# EasyEDA Pro project ProPrj_主车电路板.epro, board PCB2
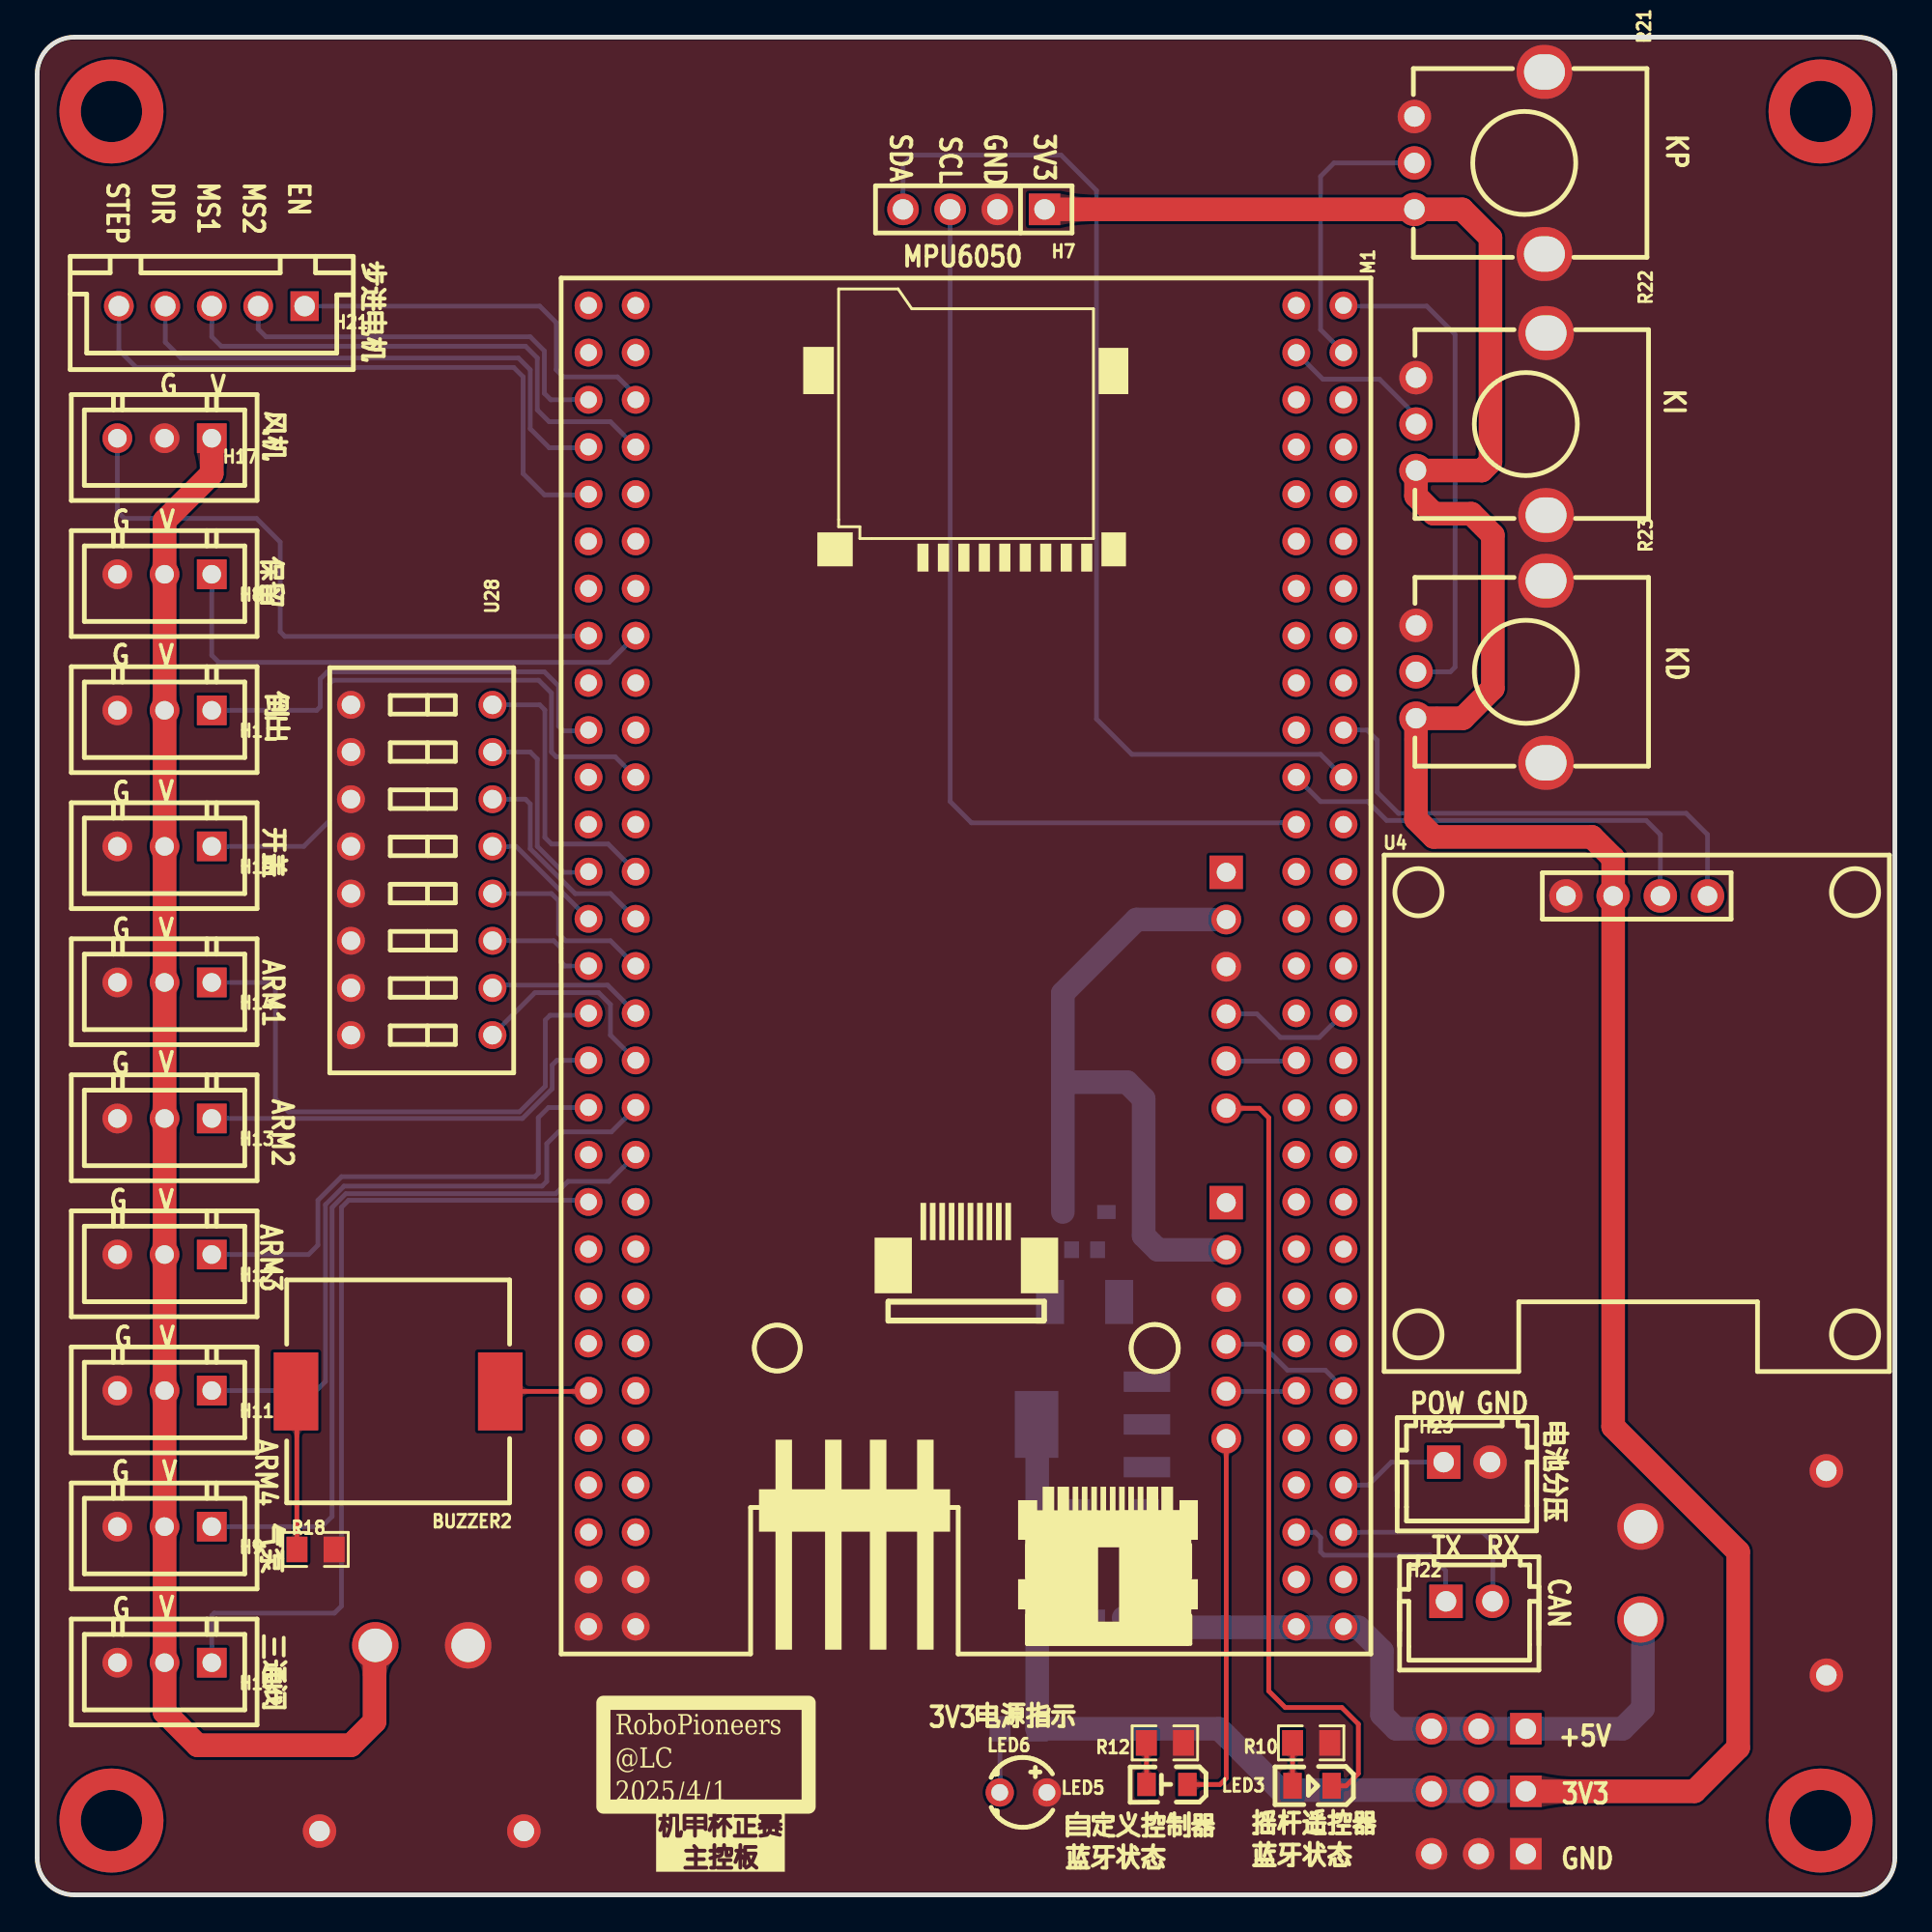
[diagram p7: board, top side]
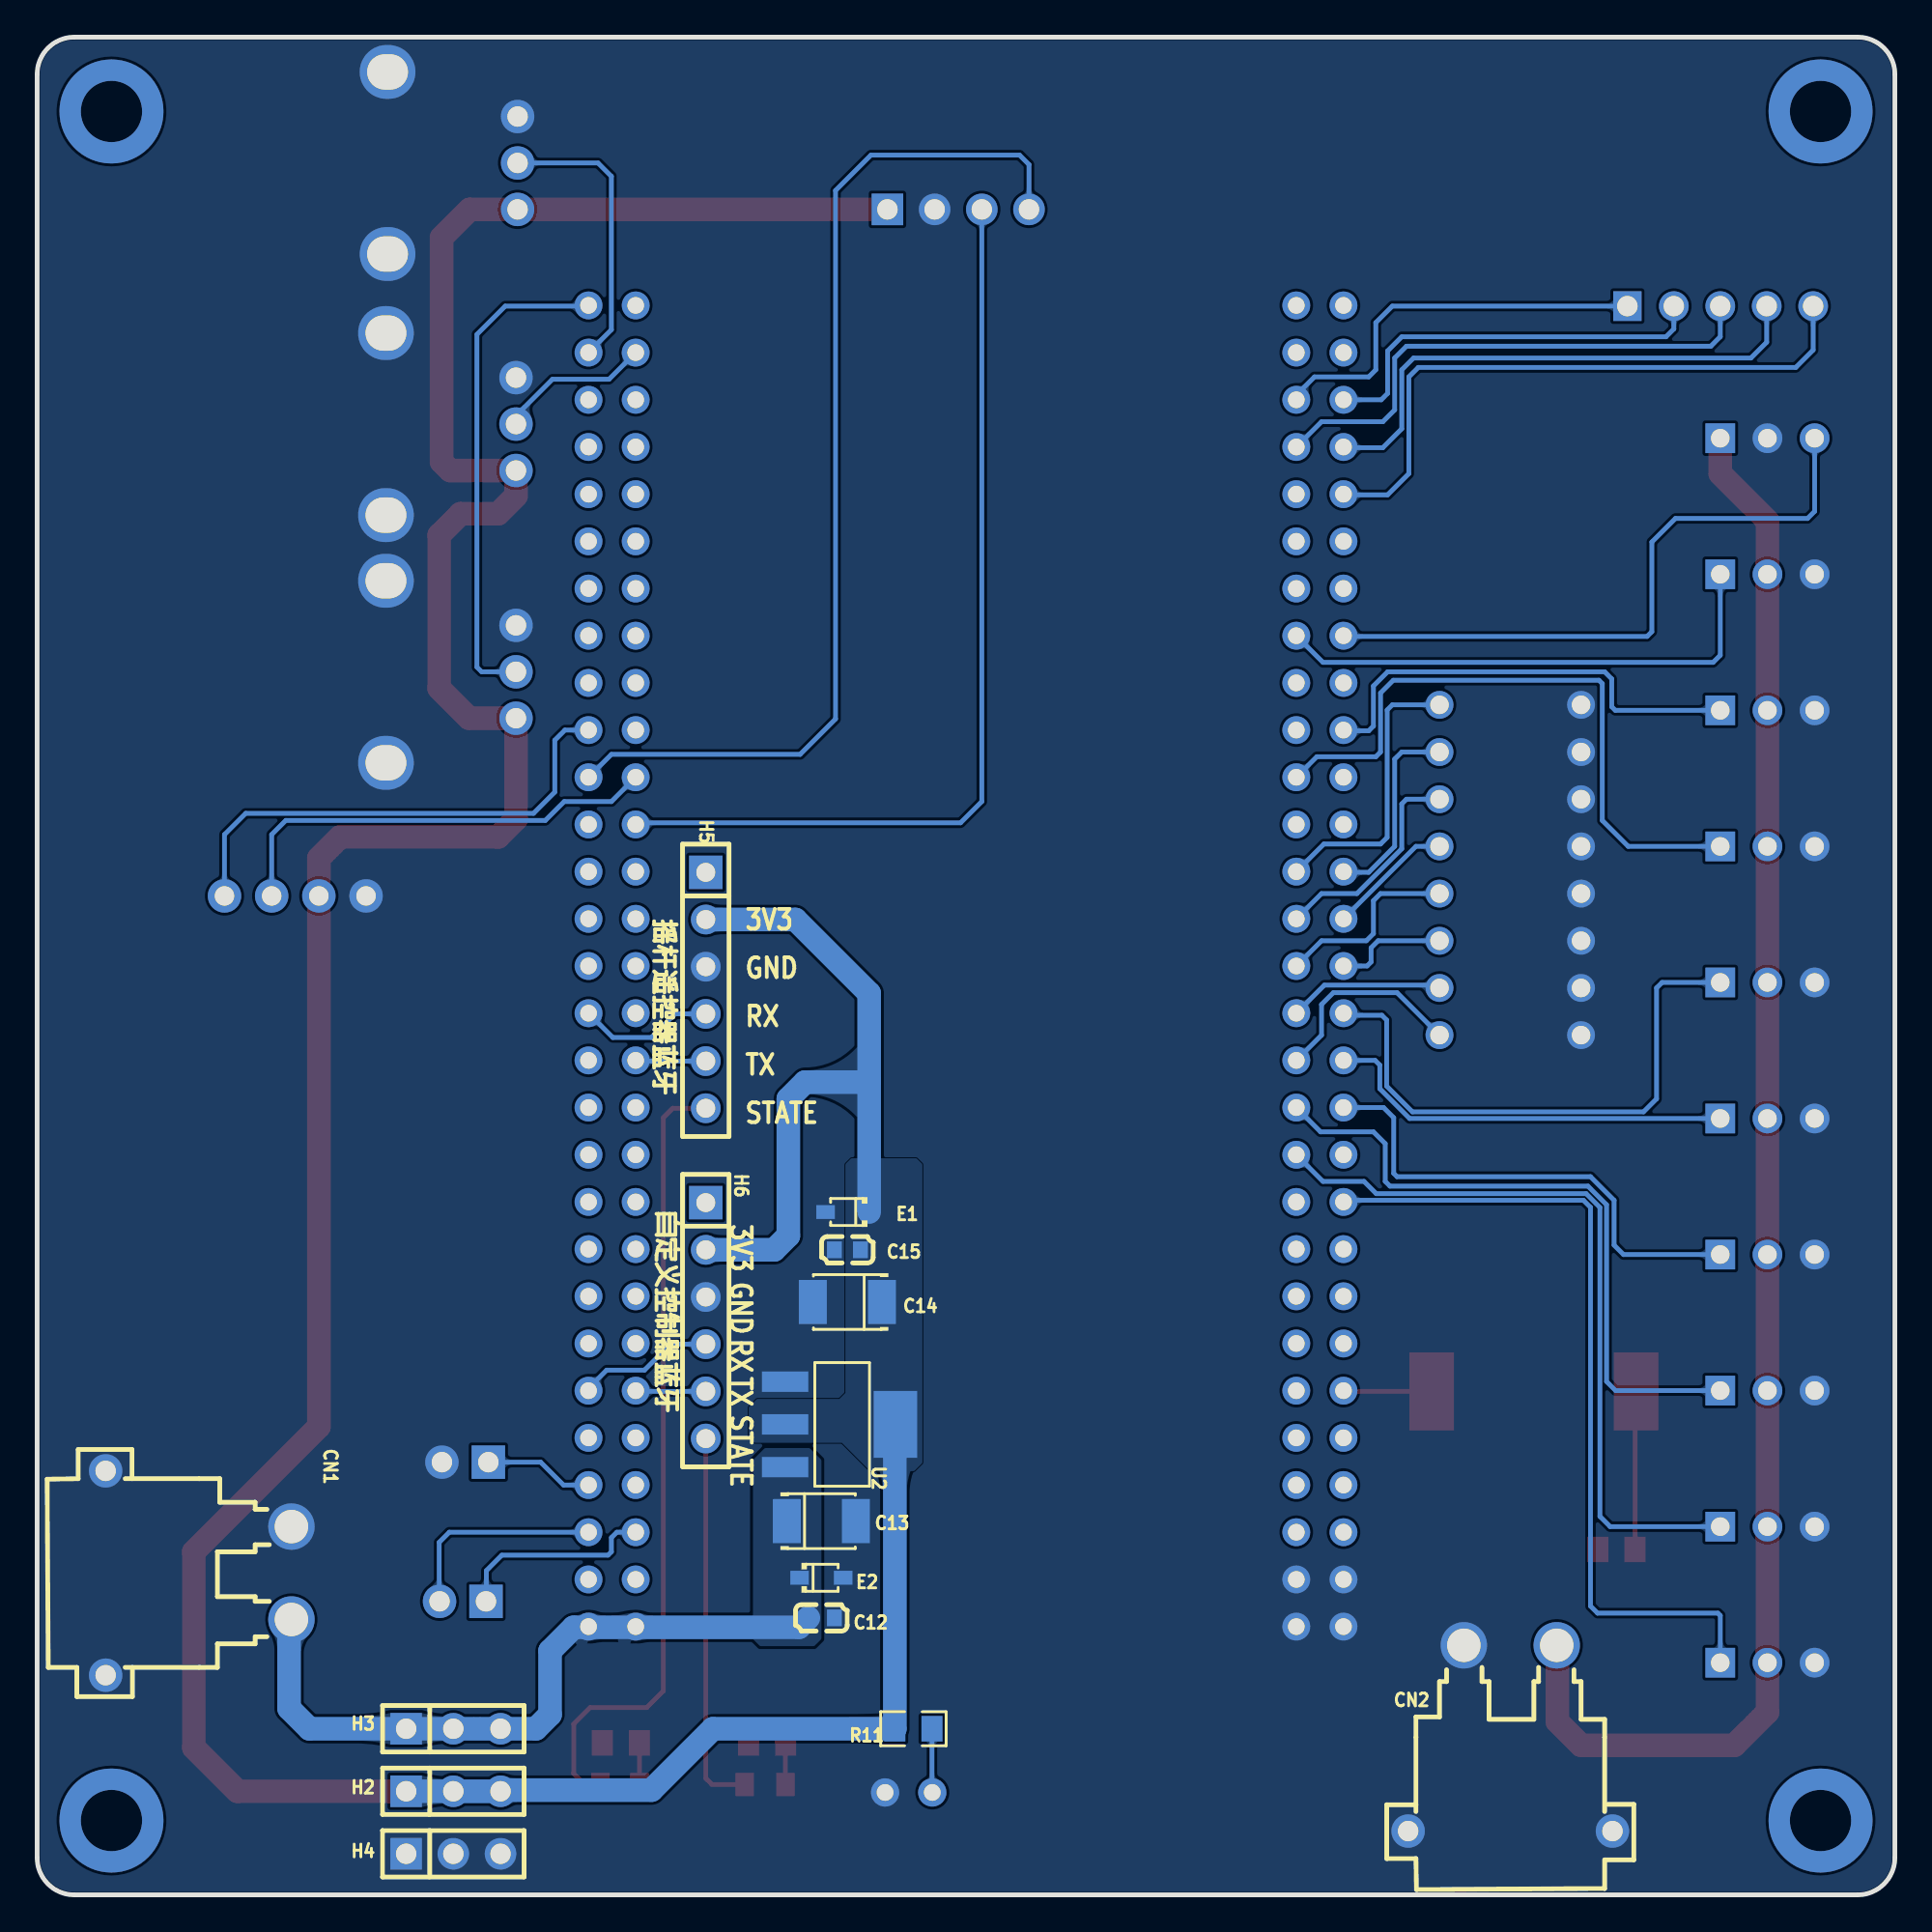
[diagram p8: board, bottom side, seen from below]

Outline 100 x 100 mm; copper layers: Top Layer, Bottom Layer. Coordinates in mm from the lower left corner of the outline.
Outline path: 0,98 0,2 arc(0.59,0.59) 2,0 98,0 arc(99.41,0.59) 100,2 100,98 arc(99.41,99.41) 98,100 2,100 arc(0.59,99.41) 0,98
Stack: Top Layer 0.035mm / Dielectric1 1.51mm FR4 er 4.5 / Bottom Layer 0.035mm

## Design rules (mm)
template: 自定义配置
spacing copperThickness1oz (default): track to track 0.102, other pairs 0.152 to 0.3
spacing copperThickness2oz: track to track 0.203, other pairs 0.152 to 0.3
track width copperThickness1oz (default): min 0.127, default 0.254, max 2.54
track width copperThickness2oz: min 0.203, default 0.254, max 2.54
differential pair differentialPair (default): width min 0.127, default 0.254, max 2.54; gap min 0.152, default 0.152
via viaSize (default): diameter min 0.5, default 0.61, max 10; hole min 0.3, default 0.305, max 6.3
net GND uses copperRegion1
net +5V uses copperRegion1
net 3V3 uses copperRegion1
pour e564 uses copperRegion1
pour e603 uses copperRegion1

## Placement (name value [footprint] x y rotation side)
BUZZER2  4kHz  [BUZ-SMD_L12.0-W12.0-P11.6]  19.43 27.1 180 top
C12  100nF  [C0603]  57.78 14.91 180 bottom
C13  220uF  [CASE-B_3528]  57.78 20.12 180 bottom
C14  220uF  [CASE-B_3528]  56.38 31.91 0 bottom
C15  100nF  [C0603]  56.38 34.72 180 bottom
CN1  XT30PW-M30.G.Y  [CONN-TH_XT30PW-M]  91.31 17.32 270 bottom
CN2  XT30PW-M30.G.Y  [CONN-TH_XT30PW-M]  20.7 8.43 180 bottom
E1  CESD3V3D3 YU  [SOD-323_L1.8-W1.3-LS2.5-RD]  56.38 36.76 0 bottom
E2  CESD5V0D3 ZA  [SOD-323_L1.8-W1.3-LS2.5-RD]  57.78 17.07 180 bottom
H1  ZX-XH2.54-3PZZ  [CONN-TH_3P-P2.54_2501S-3P]  6.86 63.76 180 top
H2  PZ254V-11-03P  [HDR-TH_3P-P2.54-V-M]  77.6 5.58 180 bottom
H3  PZ254V-11-03P  [HDR-TH_3P-P2.54-V-M]  77.6 8.94 180 bottom
H4  PZ254V-11-03P  [HDR-TH_3P-P2.54-V-M]  77.6 2.21 180 bottom
H5  PM254V-11-06-H85  [HDR-TH_6P-P2.54-V-F]  64.01 48.69 270 bottom
H6  PM254V-11-06-H85  [HDR-TH_6P-P2.54-V-F]  64.01 30.91 270 bottom
H7  2.54-1*4P母  [HDR-TH_4P-P2.54-V-F]  50.42 90.73 180 top
H8  ZX-XH2.54-3PZZ  [CONN-TH_3P-P2.54_2501S-3P]  6.86 71.09 180 top
H9  ZX-XH2.54-3PZZ  [CONN-TH_3P-P2.54_2501S-3P]  6.86 19.82 180 top
H10  ZX-XH2.54-3PZZ  [CONN-TH_3P-P2.54_2501S-3P]  6.86 12.5 180 top
H11  ZX-XH2.54-3PZZ  [CONN-TH_3P-P2.54_2501S-3P]  6.86 27.14 180 top
H12  ZX-XH2.54-3PZZ  [CONN-TH_3P-P2.54_2501S-3P]  6.86 34.47 180 top
H13  ZX-XH2.54-3PZZ  [CONN-TH_3P-P2.54_2501S-3P]  6.86 41.79 180 top
H14  ZX-XH2.54-3PZZ  [CONN-TH_3P-P2.54_2501S-3P]  6.86 49.12 180 top
H17  ZX-XH2.54-3PZZ  [CONN-TH_3P-P2.54_2501S-3P]  6.86 78.41 180 top
H19  ZX-XH2.54-3PZZ  [CONN-TH_3P-P2.54_2501S-3P]  6.86 56.44 180 top
H21  ZX-XH2.54-5PZZ  [CONN-TH_5P-P2.50_ZX-XH2.54-5PZZ]  9.4 85.52 180 top
H22  ZX-XH2.54-2PZZ  [CONN-TH_2P-P2.50_HX25003-2A]  77.09 15.8 0 top
H23  ZX-XH2.54-2PZZ  [CONN-TH_2P-P2.50_HX25003-2A]  76.96 23.29 0 top
LED3  KT-0805Y  [LED0805-R-RD]  68.63 5.87 180 top
LED5  YLED0805B  [LED0805-RD]  60.82 5.94 180 top
LED6  LTH3MM12VFR4100  [LED-TH_BD3.8-P2.54-RD]  53.09 5.51 0 top
M1  -  [FK407M2-ZGT6]  50 50 270 top
R10  100Ω  [R0805]  68.58 8.18 0 top
R11  100Ω  [R0805]  52.83 8.94 0 bottom
R12  100Ω  [R0805]  60.71 8.18 0 top
R18  100Ω  [R0805]  14.99 18.59 0 top
R21  10kΩ  [RES-ADJ-TH_RK09K1130AJ3]  77.64 93.23 270 top
R22  10kΩ  [RES-ADJ-TH_RK09K1130AJ3]  77.72 79.17 270 top
R23  10kΩ  [RES-ADJ-TH_RK09K1130AJ3]  77.72 65.84 270 top
U2  AMS1117-3.3  [SOT-223-3_L6.5-W3.4-P2.30-LS7.0-BR]  56.77 25.32 0 bottom
U4  HS96L03W2C03  [OLED-TH_L27.8-W27.2-P2.54_C9900033791]  86.11 53.77 0 top
U28  DR-08HT  [SW-TH_16P-P2.54_SMQS-08B-TP]  20.7 55.17 270 top

## Footprints (pads in the part's own frame, mm; a bottom-side part is the same pattern mirrored in y, then rotated)
BUZ-SMD_L12.0-W12.0-P11.6
  rect 2.4x4.2 smd: 1(-5.5,0) 2(5.5,0)
C0603
  rect 0.8x0.9 smd: 1(-0.7,0) 2(0.7,0)
CASE-B_3528
  rect 1.506x2.376 smd: 1(-1.861,0) 2(1.861,0)
CONN-TH_2P-P2.50_HX25003-2A
  rect 1.8x1.8 hole 1.1: 1(-1.25,0)
  round 1.8 hole 1.1: 2(1.25,0)
CONN-TH_3P-P2.54_2501S-3P
  rect 1.6x1.6 hole 1: 1(-2.54,0)
  round 1.6 hole 1: 2(0,0) 3(2.54,0)
CONN-TH_5P-P2.50_ZX-XH2.54-5PZZ
  rect 1.524x1.6 hole 1.1: 1(-5,0)
  round 1.6 hole 1.1: 2(-2.5,0) 3(0,0) 4(2.5,0) 5(5,0)
CONN-TH_XT30PW-M
  round 2.5 hole 1.8: 1(-2.5,5) 2(2.5,5)
  round 1.8 hole 1.1: 3(5.5,-5) 4(-5.5,-5)
FK407M2-ZGT6
  round 1.5 hole 0.9: 1(35.56,20.32) 2(35.56,17.78) 3(33.02,20.32) 4(33.02,17.78) 5(30.48,20.32) 6(30.48,17.78) 7(27.94,20.32) 8(27.94,17.78) 9(25.4,20.32) 10(25.4,17.78) 11(22.86,20.32) 12(22.86,17.78) 13(20.32,20.32) 14(20.32,17.78) 15(17.78,20.32) 16(17.78,17.78) 17(15.24,20.32) 18(15.24,17.78) 19(12.7,20.32) 20(12.7,17.78) 21(10.16,20.32) 22(10.16,17.78) 23(7.62,20.32) 24(7.62,17.78) 25(5.08,20.32) 26(5.08,17.78) 27(2.54,20.32) 28(2.54,17.78) 29(0,20.32) 30(0,17.78) 31(-2.54,20.32) 32(-2.54,17.78) 33(-5.08,20.32) 34(-5.08,17.78) 35(-7.62,20.32) 36(-7.62,17.78) 37(-10.16,20.32) 38(-10.16,17.78) 39(-12.7,20.32) 40(-12.7,17.78) 41(-15.24,20.32) 42(-15.24,17.78) 43(-17.78,20.32) 44(-17.78,17.78) 45(-20.32,20.32) 46(-20.32,17.78) 47(-22.86,20.32) 48(-22.86,17.78) 49(-25.4,20.32) 50(-25.4,17.78) 51(-27.94,20.32) 52(-27.94,17.78) 53(-30.48,20.32) 54(-30.48,17.78) 55(-33.02,20.32) 56(-33.02,17.78) 57(-35.56,20.32) 58(-35.56,17.78) 59(35.56,-17.78) 60(35.56,-20.32) 61(33.02,-17.78) 62(33.02,-20.32) 63(30.48,-17.78) 64(30.48,-20.32) 65(27.94,-17.78) 66(27.94,-20.32) 67(25.4,-17.78) 68(25.4,-20.32) 69(22.86,-17.78) 70(22.86,-20.32) 71(20.32,-17.78) 72(20.32,-20.32) 73(17.78,-17.78) 74(17.78,-20.32) 75(15.24,-17.78) 76(15.24,-20.32) 77(12.7,-17.78) 78(12.7,-20.32) 79(10.16,-17.78) 80(10.16,-20.32) 81(7.62,-17.78) 82(7.62,-20.32) 83(5.08,-17.78) 84(5.08,-20.32) 85(2.54,-17.78) 86(2.54,-20.32) 87(0,-17.78) 88(0,-20.32) 89(-2.54,-17.78) 90(-2.54,-20.32) 91(-5.08,-17.78) 92(-5.08,-20.32) 93(-7.62,-17.78) 94(-7.62,-20.32) 95(-10.16,-17.78) 96(-10.16,-20.32) 97(-12.7,-17.78) 98(-12.7,-20.32) 99(-15.24,-17.78) 100(-15.24,-20.32) 101(-17.78,-17.78) 102(-17.78,-20.32) 103(-20.32,-17.78) 104(-20.32,-20.32) 105(-22.86,-17.78) 106(-22.86,-20.32) 107(-25.4,-17.78) 108(-25.4,-20.32) 109(-27.94,-17.78) 110(-27.94,-20.32) 111(-30.48,-17.78) 112(-30.48,-20.32) 113(-33.02,-17.78) 114(-33.02,-20.32) 115(-35.56,-17.78) 116(-35.56,-20.32)
HDR-TH_3P-P2.54-V-M
  rect 1.7x1.7 hole 1.1: 1(-2.54,0)
  round 1.7 hole 1.1: 2(0,0) 3(2.54,0)
HDR-TH_4P-P2.54-V-F
  rect 1.7x1.7 hole 1.1: 1(-3.81,0)
  round 1.7 hole 1.1: 2(-1.27,0) 3(1.27,0) 4(3.81,0)
HDR-TH_6P-P2.54-V-F
  rect 1.8x1.8 hole 1.02: 1(-6.35,0)
  round 1.6 hole 1.02: 2(-3.81,0) 3(-1.27,0) 4(1.27,0) 5(3.81,0) 6(6.35,0)
LED0805-R-RD
  rect 1x1.399 smd: 1(1.05,0) 2(-1.05,0)
LED0805-RD
  rect 1x1.25 smd: 1(-1.1,0) 2(1.1,0)
LED-TH_BD3.8-P2.54-RD
  round 1.524 hole 0.9: 1(-1.27,0) 2(1.27,0)
OLED-TH_L27.8-W27.2-P2.54_C9900033791
  round 1.8 hole 1.05: 1(-3.81,0) 2(-1.27,0) 3(1.27,0) 4(3.81,0)
R0805
  rect 1.133x1.377 smd: 1(-1,0) 2(1,0)
RES-ADJ-TH_RK09K1130AJ3
  round 1.8 hole 1.1: 1(-2.5,-3.5) 2(0,-3.5) 3(2.5,-3.5)
  oval 2.9x3 hole 1.9x2.2: 4(-4.9,3.5) 5(4.9,3.5)
SOD-323_L1.8-W1.3-LS2.5-RD
  rect 1x0.75 smd: 1(-1.173,0) 2(1.173,0)
SOT-223-3_L6.5-W3.4-P2.30-LS7.0-BR
  rect 2.5x1.1 smd: 1(2.97,-2.3) 2(2.97,0) 3(2.97,2.3)
  rect 2.34x3.6 smd: 4(-2.97,0)
SW-TH_16P-P2.54_SMQS-08B-TP
  round 1.5 hole 1: 1(-8.89,-3.81) 2(-6.35,-3.81) 3(-3.81,-3.81) 4(-1.27,-3.81) 5(1.27,-3.81) 6(3.81,-3.81) 7(6.35,-3.81) 8(8.89,-3.81) 9(8.89,3.81) 10(6.35,3.81) 11(3.81,3.81) 12(1.27,3.81) 13(-1.27,3.81) 14(-3.81,3.81) 15(-6.35,3.81) 16(-8.89,3.81)

## Nets
As in the schematic.

Pads without a net: H5 1; H6 1; M1 3 4 8 9 10 13 14 15 16 17 18 19 20 21 22 23 24 25 28 29 30 31 32 33 34 35 40 41 42 43 44 45 46 47 48 49 50 51 52 53 54 58 63 64 65 66 67 68 69 71 72 73 74 75 76 77 80 93 94 96 97 99 100 103 104 105 106 107 113 114 115 116

## Via types
v1: diameter 5.6, hole 3.3, Top Layer to Bottom Layer, 4 vias

## Routing (per net, layer and track width the routed paths; a pad name or vN(x,y) marks a point on that pad's centre or on a via; arc(x,y) is an arc through that point)
3V3: length 223.5
  Top Layer w1.27: H2.1 89.22,5.58 91.57,7.93 91.57,18.47 84.84,25.2 U4.2 84.84,55.8 83.69,56.95 75.18,56.95 74.22,57.91 R23.3 76.75,63.34 78.36,64.95 78.36,73.19 77.21,74.35 75.18,74.35 74.22,75.31 R22.3 77.76,76.67 78.23,77.14 78.23,89.2 76.71,90.73 H7.1
  Bottom Layer w1.27: 55.21,43.83 55.21,48.53 59.18,52.5 H5.2 ; 55.21,43.83 E1.1 ; 55.21,43.83 55.29,43.75 58.66,43.75 59.56,42.85 59.56,35.48 60.32,34.72 H6.2 ; U2.4 53.83,25.29 R11.2 63.63,8.94 66.93,5.64 74.99,5.64 75.06,5.58 H2.2 H2.1
+5V: length 37.7
  Bottom Layer w1.27: C12.1 58.99,14.4 71.12,14.4 72.39,13.13 72.39,9.7 73.15,8.94 H3.2 H3.1 85.34,8.94 86.44,10.04 86.44,14.7 CN1.2
(no net):
  vias: v1(4,96) v1(4,4) v1(96,96) v1(96,4)
ARM1: length 30.9
  Bottom Layer w0.254: M1.86 29.57,47.35 27.61,47.35 27.36,47.09 27.36,43.54 25.97,42.15 13.53,42.15 12.83,42.85 12.83,48.82 12.53,49.11 H14.1
ARM2: length 22.3
  Bottom Layer w0.254: M1.84 27.98,44.92 27.72,44.67 27.72,43.4 26.12,41.79 H13.1
ARM3: length 26.7
  Bottom Layer w0.254: H12.1 14.61,34.47 15.11,34.98 15.11,37.39 16.38,38.66 26.8,38.66 26.98,38.84 26.98,41.83 27.52,42.38 M1.82
ARM4: length 35.9
  Bottom Layer w0.254: M1.81 30.91,41.07 28.07,41.07 27.43,40.44 27.43,38.41 27.18,38.15 16.52,38.15 15.52,37.15 15.52,27.63 15.03,27.14 H11.1
BUZ: length 4.8
  Top Layer w0.254: M1.70 29.64,27.1 BUZZER2.1
CAN_RX: length 11.4
  Bottom Layer w0.254: H22.2 78.36,15.82 78.36,18.97 77.81,19.52 M1.5
CAN_TX: length 11
  Bottom Layer w0.254: M1.6 68.8,19.52 69.09,19.23 69.09,18.47 69.27,18.29 74.98,18.29 75.82,17.45 75.82,15.82 H22.1
DIR: length 29
  Bottom Layer w0.254: M1.110 29.64,77.9 27.56,77.9 26.54,78.92 26.54,82.09 25.91,82.73 7.75,82.73 6.9,83.58 H21.4
DROP: length 34.9
  Bottom Layer w0.254: M1.95 31.12,61.27 27.94,61.27 27.69,61.52 27.69,64.69 27,65.38 15.93,65.38 15.75,65.2 15.75,57.84 14.35,56.44 H19.1
EN: length 21.5
  Bottom Layer w0.254: M1.111 32.22,80.73 31.24,81.71 28.32,81.71 27.94,82.09 27.94,84.63 27.05,85.52 H21.1
FAN: length 34.9
  Bottom Layer w0.254: H17.3 4.32,74.47 4.7,74.09 11.81,74.09 13.08,72.82 13.08,68 13.33,67.74 29.64,67.74 M1.102
HC04_1_STATE: length 43.3
  Top Layer w0.254: H5.6 65.79,42.34 66.29,41.83 66.29,10.97 67.18,10.08 70.23,10.08 71.12,9.19 71.12,6.53 70.46,5.87 LED3.2
HC04_2_STATE: length 20.5
  Top Layer w0.254: H6.6 64.01,6.27 63.68,5.94 LED5.1
I2C1_SCL: length 51
  Bottom Layer w0.254: H7.3 49.15,58.85 50.29,57.71 67.69,57.71 M1.36
I2C1_SDA: length 56.9
  Bottom Layer w0.254: H7.4 46.61,93.14 47.12,93.65 55.12,93.65 57.02,91.75 57.02,63.3 58.93,61.39 69.09,61.39 M1.37
KEY1: length 15.4
  Bottom Layer w0.254: M1.91 30.73,56.57 27.69,56.57 27.33,56.92 27.33,63.78 27.05,64.06 U28.16
KEY2: length 10.6
  Bottom Layer w0.254: 24.51,61.52 26.54,61.52 26.92,61.14 26.92,56.44 28.32,55.04 29.64,55.04 M1.92
KEY3: length 11.8
  Bottom Layer w0.254: M1.89 30.86,53.9 28.96,53.9 26.54,56.31 26.54,58.72 26.29,58.98 U28.14
KEY4: length 6.8
  Bottom Layer w0.254: U28.13 25.78,56.44 M1.90
KEY5: length 10.4
  Bottom Layer w0.254: M1.87 30.86,51.36 28.45,51.36 28.07,51.74 28.07,53.52 27.69,53.9 U28.12
KEY6: length 6.2
  Bottom Layer w0.254: M1.88 28.41,50 28.19,50.22 28.19,50.98 27.81,51.36 U28.11
KEY7: length 8.4
  Bottom Layer w0.254: U28.10 24.66,48.97 30.71,48.97 M1.85
KEY8: length 11.1
  Bottom Layer w0.254: U28.9 26.8,48.56 30.23,48.56 30.86,47.93 30.86,46.28 M1.83
MS1: length 28.6
  Bottom Layer w0.254: H21.3 9.4,83.87 9.91,83.36 26.29,83.36 26.92,82.73 26.92,79.93 27.56,79.3 30.86,79.3 M1.109
MS2: length 21.9
  Bottom Layer w0.254: M1.112 27.65,80.48 27.31,80.82 27.31,83.11 26.54,83.87 12.32,83.87 11.9,84.29 H21.2
OLED_SCL: length 24.2
  Bottom Layer w0.254: U4.3 87.38,57.07 86.61,57.84 72.64,57.84 71.63,58.85 69.09,58.85 M1.38
OLED_SDA: length 26.9
  Bottom Layer w0.254: M1.39 71.59,62.7 72.14,62.15 72.14,59.36 73.28,58.22 88.77,58.22 89.92,57.07 U4.4
PID_KD: length 26.8
  Bottom Layer w0.254: R23.2 76.07,65.84 76.33,66.09 76.33,84 74.8,85.52 70.36,85.52 M1.57
PID_KI: length 8.3
  Bottom Layer w0.254: R22.2 74.22,79.62 72.26,81.58 69.22,81.58 M1.56
PID_KP: length 15.3
  Bottom Layer w0.254: M1.55 69.09,84.25 69.09,92.51 69.81,93.23 R21.2
POUROUT: length 24.6
  Bottom Layer w0.254: M1.98 29.64,62.66 28.32,62.66 28.07,62.92 28.07,65.08 27.31,65.84 15.62,65.84 15.24,65.46 15.24,63.95 15.05,63.76 H1.1
POWER: length 5.9
  Bottom Layer w0.254: M1.7 71.67,22.06 72.9,23.29 H23.1
PUMP: length 40.9
  Bottom Layer w0.254: M1.79 30.78,38.41 28.57,38.41 27.92,37.75 16.62,37.75 15.88,37 15.88,20.37 15.32,19.82 H9.1
STEP: length 33.9
  Bottom Layer w0.254: H21.5 4.4,83.16 5.33,82.22 25.65,82.22 26.16,81.71 26.16,76.5 27.31,75.36 29.64,75.36 M1.108
UNCAP: length 27.9
  Bottom Layer w0.254: H8.1 9.4,66.73 9.78,66.34 30.78,66.34 M1.101
USART2_RX: length 7.4
  Bottom Layer w0.254: M1.27 69.01,46.15 66.93,46.15 65.66,47.42 H5.4
USART2_TX: length 3.8
  Bottom Layer w0.254: H5.5 67.74,44.88 M1.26
USART6_RX: length 7.4
  Bottom Layer w0.254: M1.11 70.32,27.27 69.34,28.25 67.31,28.25 65.91,29.64 H6.4
USART6_TX: length 3.8
  Bottom Layer w0.254: H6.5 67.74,27.1 M1.12
VALVE: length 44.7
  Bottom Layer w0.254: M1.78 29.59,37.39 16.76,37.39 16.38,37.01 16.38,15.54 16,15.16 9.53,15.16 9.4,15.04 H10.1
VS: length 86.3
  Top Layer w1.27: H17.1 9.4,76.5 6.86,73.97 H8.2 H19.2 H14.2 H13.2 H12.2 H11.2 H9.2 H10.2 6.86,9.83 8.64,8.05 16.89,8.05 18.16,9.32 18.16,13.39 CN2.2
$1N1967: length 3.5
  Bottom Layer w0.254: 51.69,5.51 51.83,5.66 R11.1
$1N3310: length 8.4
  Top Layer w0.254: 13.98,18.72 13.98,27.05 BUZZER2.2
$1N3328: length 2.1
  Top Layer w0.254: 67.49,7.9 67.58,7.82 LED3.1
$1N3330: length 2
  Top Layer w0.254: LED5.2 59.72,7.87 59.75,7.9

## Copper pours and planes (outline as drawn; the poured copper is in the pictures)
3V3 on Bottom Layer: 61.21,26.59 56.77,26.59 56.39,26.97 56.39,39.29 56.13,39.55 52.71,39.55 52.45,39.29 52.45,23.29 52.83,22.91 55.12,22.91 56.64,24.44 61.34,24.44 61.59,24.69 61.59,26.21
+5V on Bottom Layer: 60.83,24.05 58.42,24.05 57.78,23.42 57.78,13.77 58.17,13.39 61.09,13.39 61.47,13.77 61.47,23.41
GND on Top Layer: -24.51,119.18 124.84,119.18 124.84,-42.37 -24.51,-42.37
GND on Bottom Layer: -7.11,108.64 109.47,108.64 109.47,-8.97 -7.11,-8.97

Small or netless copper shapes (teardrops, artwork), in the pictures only: 42 on Top Layer, 97 on Bottom Layer

## Text on the board
Bottom Silkscreen Layer: 3V3 | GND | RX | TX | STATE | 自定义控制器蓝牙 | 摇杆遥控器蓝牙
Top Silkscreen Layer: G | V | STEP | DIR | MS1 | MS2 | ARM4 | ARM3 | ARM1 | ARM2 | EN | KI | KP | KD | MPU6050 | POW | TX | GND | RX | +5V | 3V3 | SDA | SCL | CAN | RoboPioneers / @LC / 2025/4/1 | 保留 | 气泵 | 风机 | 开盖 | 三通阀 | 倒出 | 步进电机 | 电池分压 | 摇杆遥控器 / 蓝牙状态 | 3V3电源指示 | 自定义控制器 / 蓝牙状态 | 机甲杯正赛 / 主控板
